# Altium schematic sheet [21] USB.SchDoc: USB
size 393 x 281 mm; SheetNumber: 21; SheetTotal: 21; PageSetup: Record=PageOptions|CenterHorizontal=True|CenterVertical=True|PrintScale=0.94|XCorrection=0.00|YCorrection=0.00|PrintKind=0|BorderSize=5000000|LeftOffset=0|BottomOffset=0|Orientation=2|PaperLength=1000|PaperWidth=1000|Scale=100|PaperSource=15|PrintQuality=600|MediaType=1|DitherType=10|PrintScaleMode=1|PaperKind=A4; Adr1: August Barks gata 6B; Adr2: SE-421 32 Västra Frölunda; Adr3: Sweden; Webpage: www.omnisys.se
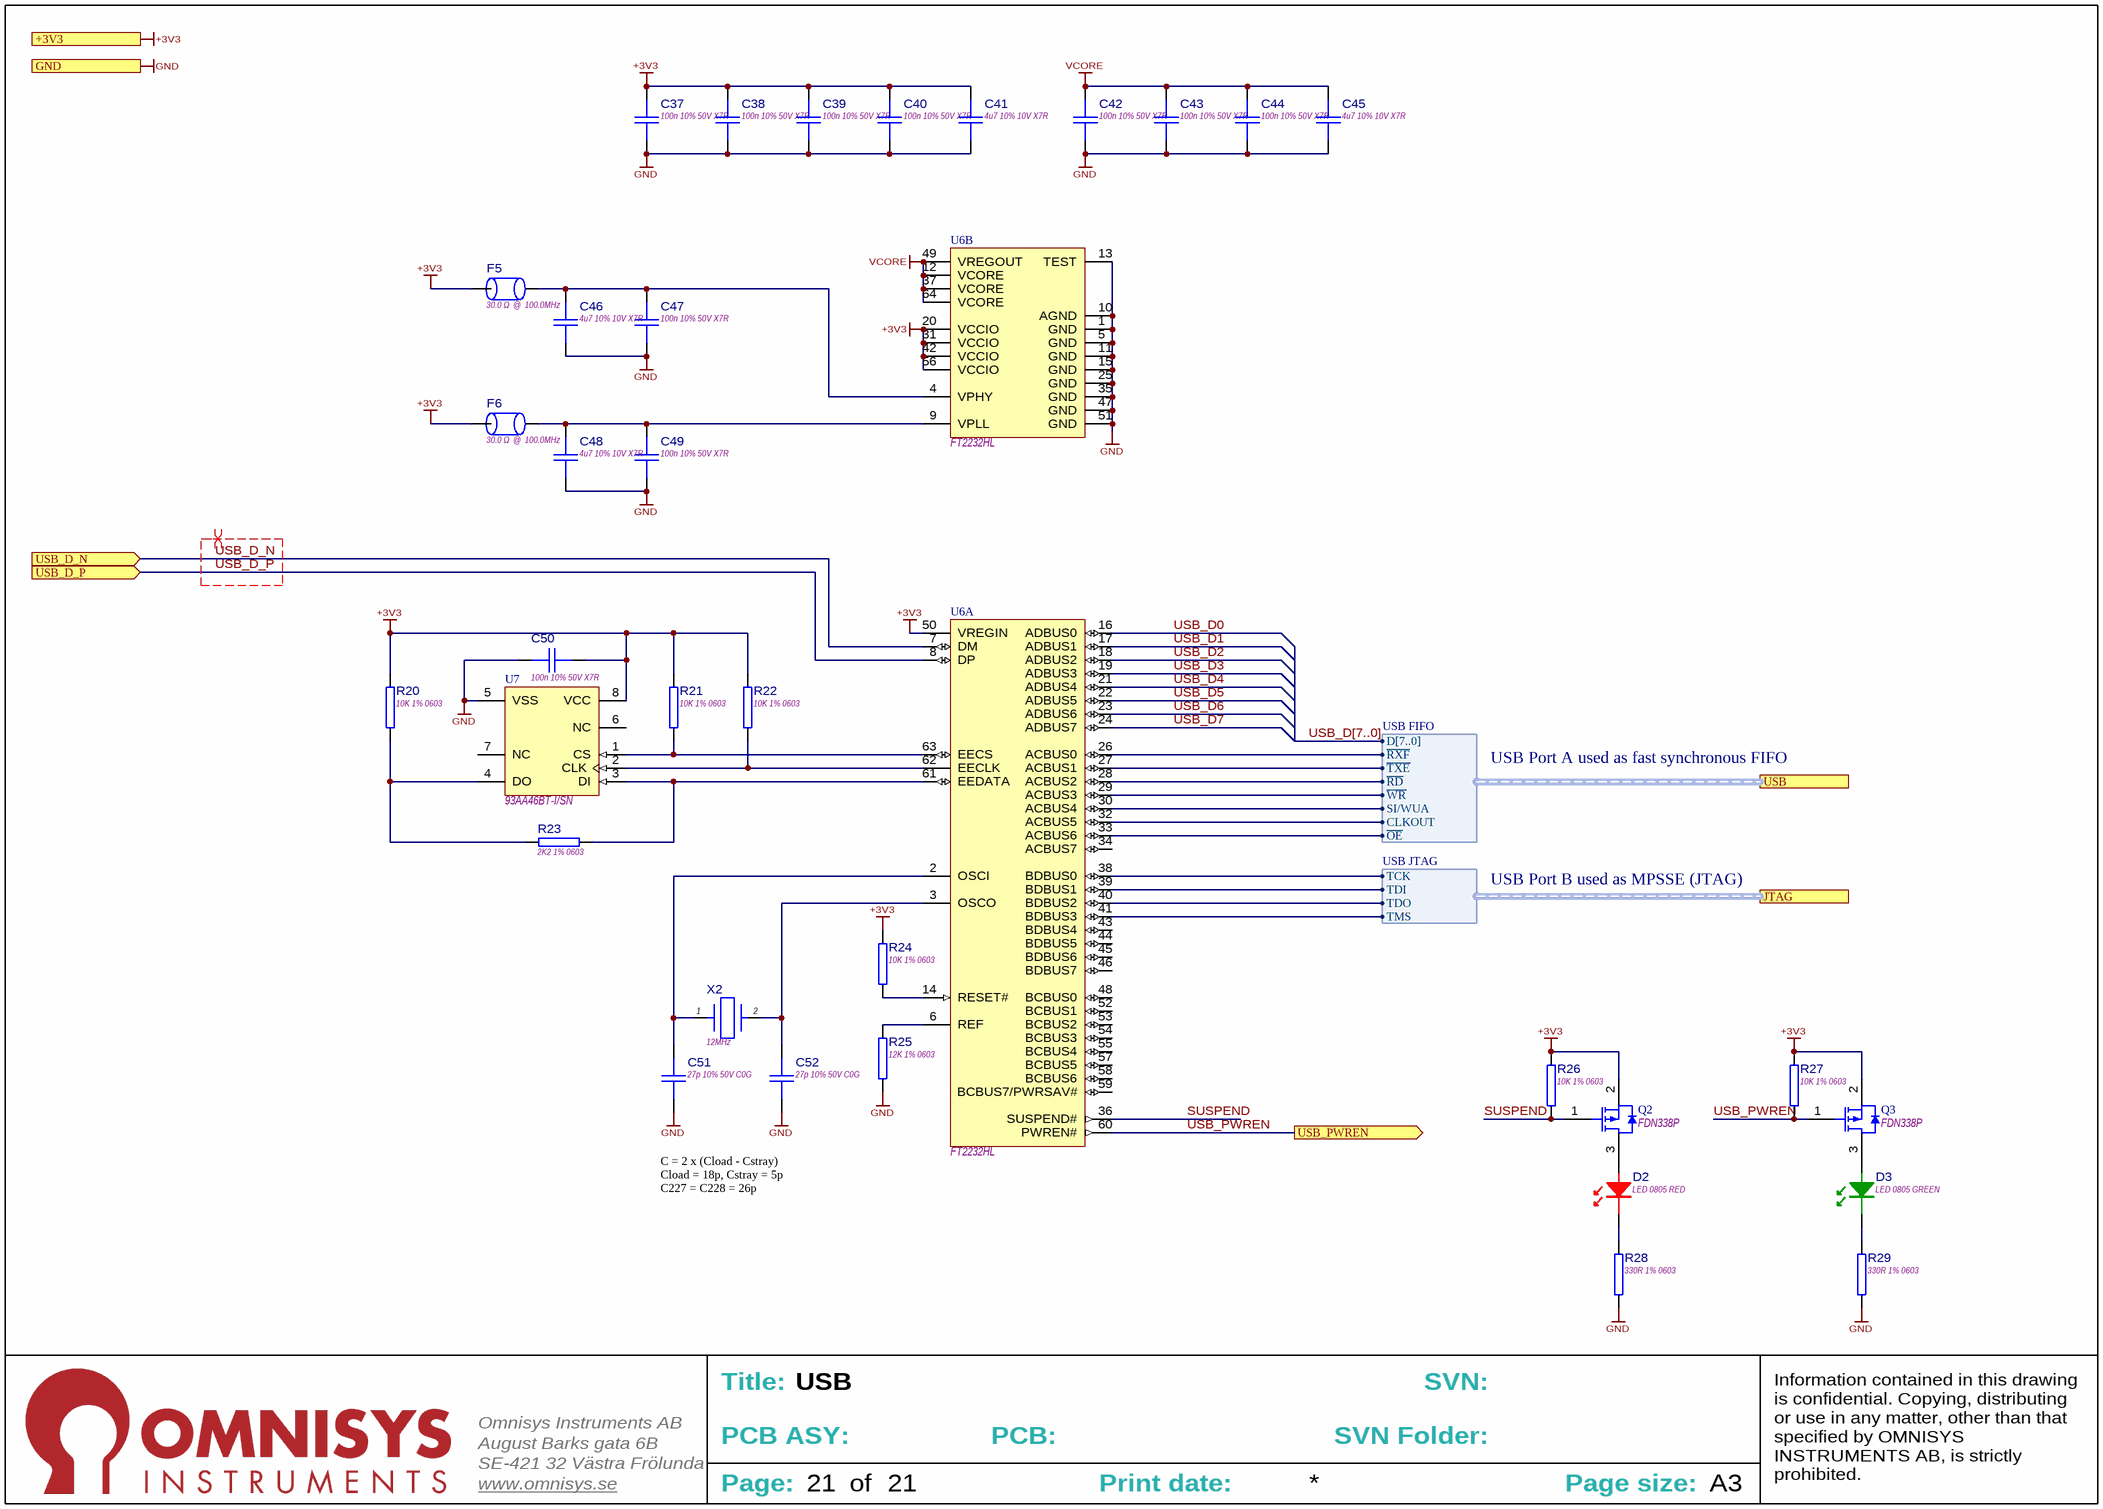
[diagram p0: [21] USB.SchDoc]

## Parts
C37  100n 10% 50V X7R  [CAPC1608X90N]
C38  100n 10% 50V X7R  [CAPC1608X90N]
C39  100n 10% 50V X7R  [CAPC1608X90N]
C40  100n 10% 50V X7R  [CAPC1608X90N]
C41  4u7 10% 10V X7R  [CAPC2012X145N]
C42  100n 10% 50V X7R  [CAPC1608X90N]
C43  100n 10% 50V X7R  [CAPC1608X90N]
C44  100n 10% 50V X7R  [CAPC1608X90N]
C45  4u7 10% 10V X7R  [CAPC2012X145N]
C46  4u7 10% 10V X7R  [CAPC2012X145N]
C47  100n 10% 50V X7R  [CAPC1608X90N]
C48  4u7 10% 10V X7R  [CAPC2012X145N]
C49  100n 10% 50V X7R  [CAPC1608X90N]
C50  100n 10% 50V X7R  [CAPC1608X90N]
C51  27p 10% 50V C0G  [CAPC1608X90N]
C52  27p 10% 50V C0G  [CAPC1608X90N]
D2  LED 0805 RED  [LED2012-RED]
D3  LED 0805 GREEN  [LED2012-GREEN]
F5  30.0 Ω  @  100.0MHz  [INDC2012X11N]
F6  30.0 Ω  @  100.0MHz  [INDC2012X11N]
Q2  FDN338P  [SOT95P230X110-3N]
Q3  FDN338P  [SOT95P230X110-3N]
R20  10K 1% 0603  [RESC1608N]
R21  10K 1% 0603  [RESC1608N]
R22  10K 1% 0603  [RESC1608N]
R23  2K2 1% 0603  [RESC1608N]
R24  10K 1% 0603  [RESC1608N]
R25  12K 1% 0603  [RESC1608N]
R26  10K 1% 0603  [RESC1608N]
R27  10K 1% 0603  [RESC1608N]
R28  330R 1% 0603  [RESC1608N]
R29  330R 1% 0603  [RESC1608N]
U6  FT2232HL  [FTDI-LQFP-64_L]  (parts A,B of 2)
U7  93AA46BT-I/SN  [SOIC127P600X175-8N]
X2  12MHz  [XTAL_5x3.2MM]

## Ports
+3V3, GND, JTAG (harness USB JTAG), USB (harness USB FIFO), USB_D_N (in), USB_D_P (in), USB_PWREN (out)

## Harnesses
USB JTAG: TCK, TDI, TDO, TMS
USB FIFO: D[7..0], ~{RXF}, ~{TXE}, ~{RD}, ~{WR}, SI/WUA, CLKOUT, ~{OE}

## Nets
+3V3: C37.1 C38.1 C39.1 C40.1 C41.2 C50.2 F5.1 F6.1 Q2.2(SOURCE) Q3.2(SOURCE) R20.2 R21.2 R22.2 R24.1 R26.2 R27.2 U6.20(VCCIO) U6.31(VCCIO) U6.42(VCCIO) U6.50(VREGIN) U6.56(VCCIO) U7.8(VCC) ; port +3V3
GND: C37.2 C38.2 C39.2 C40.2 C41.1 C42.2 C43.2 C44.2 C45.1 C46.1 C47.1 C48.1 C49.1 C50.1 C51.1 C52.1 R25.1 R28.1 R29.1 U6.1(GND) U6.5(GND) U6.10(AGND) U6.11(GND) U6.13(TEST) U6.15(GND) U6.25(GND) U6.35(GND) U6.47(GND) U6.51(GND) U7.5(VSS) ; port GND
VCORE: C42.1 C43.1 C44.1 C45.2 U6.12(VCORE) U6.37(VCORE) U6.49(VREGOUT) U6.64(VCORE)
SUSPEND: Q2.1(GATE) R26.1 U6.36(SUSPEND#)
USB_D0: U6.16(ADBUS0)
USB_D1: U6.17(ADBUS1)
USB_D2: U6.18(ADBUS2)
USB_D3: U6.19(ADBUS3)
USB_D4: U6.21(ADBUS4)
USB_D5: U6.22(ADBUS5)
USB_D6: U6.23(ADBUS6)
USB_D7: U6.24(ADBUS7)
USB_D_N: U6.7(DM) ; port USB_D_N
USB_D_P: U6.8(DP) ; port USB_D_P
USB_PWREN: Q3.1(GATE) R27.1 U6.60(PWREN#) ; port USB_PWREN
NetC46_2: C46.2 C47.2 F5.2 U6.4(VPHY)
NetC48_2: C48.2 C49.2 F6.2 U6.9(VPLL)
NetC51_2: C51.2 U6.2(OSCI) X2.1
NetC52_2: C52.2 U6.3(OSCO) X2.2
NetD2_1: D2.1 R28.2
NetD2_2: D2.2 Q2.3(DRAIN)
NetD3_1: D3.1 R29.2
NetD3_2: D3.2 Q3.3(DRAIN)
NetR20_1: R20.1 R23.1 U7.4(DO)
NetR21_1: R21.1 U6.63(EECS) U7.1(CS)
NetR22_1: R22.1 U6.62(EECLK) U7.2(CLK)
NetR23_2: R23.2 U6.61(EEDATA) U7.3(DI)
NetR24_2: R24.2 U6.14(RESET#)
NetR25_2: R25.2 U6.6(REF)
NetU6_26: U6.26(ACBUS0) ; port USB.~{RXF}
NetU6_27: U6.27(ACBUS1) ; port USB.~{TXE}
NetU6_28: U6.28(ACBUS2) ; port USB.~{RD}
NetU6_29: U6.29(ACBUS3) ; port USB.~{WR}
NetU6_30: U6.30(ACBUS4) ; port USB.SI/WUA
NetU6_32: U6.32(ACBUS5) ; port USB.CLKOUT
NetU6_33: U6.33(ACBUS6) ; port USB.~{OE}
NetU6_38: U6.38(BDBUS0) ; port JTAG.TCK
NetU6_39: U6.39(BDBUS1) ; port JTAG.TDI
NetU6_40: U6.40(BDBUS2) ; port JTAG.TDO
NetU6_41: U6.41(BDBUS3) ; port JTAG.TMS

Not connected (* = marked no-connect by the designer): U6 34(ACBUS7) 43(BDBUS4) 44(BDBUS5) 45(BDBUS6) 46(BDBUS7) 48(BCBUS0) 52(BCBUS1) 53(BCBUS2) 54(BCBUS3) 55(BCBUS4) 57(BCBUS5) 58(BCBUS6) 59(BCBUS7/PWRSAV#); U7 6(NC) 7(NC)

## Buses and harness runs
bus USB_D[7..0]

## Layout directives
differential pair; rule Differential Pairs Routing [Pref Gap = 0.1mm    Min Gap  = 0.1mm    Max Gap  = 0.1mmPref Width = 0.1mm    Min Width  = 0.1mm    Max Width  = 0.1mm]; net class Diffpairs_USB: USB_D_N, USB_D_P

## Notes on the sheet
- USB Port A used as fast synchronous FIFO
- USB Port B used as MPSSE (JTAG)
- C = 2 x (Cload - Cstray)
  Cload = 18p, Cstray = 5p
  C227 = C228 = 26p
- Title:
- SVN:
- August Barks gata 6B
- SE-421 32 Västra Frölunda
- Omnisys Instruments AB
- PCB ASY:
- PCB:
- SVN Folder:
- www.omnisys.se
- Page:
- of
- Print date:
- Page size:
- A3
- Information contained in this drawing is confidential. Copying, distributing or use in any matter, other than that specified by OMNISYS INSTRUMENTS AB, is strictly prohibited.

## Library data of the parts
C37-C40 C42-C44 C47 C49 C50 = CMP-0300-002665-6: Ceramic Chip Capacitor, 0603/1608; Capacitance: 100nF; Package: 1608/0603; Temperature Charateristics: X7R; Tolerance: 10%; Rated Voltage: 50V; Thickness: 900µm; Weight: 9mg
C41 C45 C46 C48 = CMP-0300-003983-5: Ceramic Chip Capacitor, 0805/2012; Capacitance: 4.7µF; Package: 2012/0805; Temperature Charateristics: X7R; Tolerance: 10%; Thickness: 1.4mm; Rated Voltage: 10V
C51 C52 = CMP-0300-002442-6: Ceramic Chip Capacitor, 0603/1608; Tolerance: 5%; Capacitance: 27pF; Package: 1608/0603; Temperature Charateristics: C0G; Rated Voltage: 50V; Thickness: 900µm; Weight: 9mg
D2 = CMP-1500-000001-3
D3 = CMP-1500-000004-3
F5 F6 = CMP-0600-000010-2: Ferrite bead, Würth Elektronik WE-CBF 2012 (0805), 74279206 ,  30.0 Ω  @  100.0MHz; Zmax@Freq: 55.0 Ω  @      1.0 GHz; Type: High Current; RDC: 25.0 mΩ; IDC: 3.0 A; Z@Freq: 30.0 Ω  @  100.0MHz; PartNumber: 74279206
Q2 Q3 = CMP-1700-000037-1: ON SEMICONDUCTOR - FDN338P - P CHANNEL MOSFET, -20V, 1.6A SUPER SOT-3; Drain to Source Voltage (Vdss): 20V; Current Rating: -1.6A; Drain to Source Resistance: 115mR; Element Configuration: Single; Fall Time: 11ns; Gate to Source Voltage (Vgs): 8V; Input Capacitance: 451pF; Max Power Dissipation: 460mW; Nominal Vgs: -800mV; Number of Elements: 1; Power Dissipation: 500mW; RDS(on): 0.115; Turn-Off Delay Time: 16ns; Turn-On Delay Time: 10ns; Packaging: Tape and Reel; Case/Package: TO-236-3; Contact Plating: Tin,Matte; Continuous Drain Current (ID): 1.6A; Drain to Source Breakdown Voltage: -20V; Lead Free: Lead Free; Max Operating Temperature: 150°C; Min Operating Temperature: -55°C; Mount: Surface Mount; Number of Pins: 3; On-State Resistance: 115mR; Package Quantity: 3000; PartNumber: FDN338P; Radiation Hardening: No; Rds On Max: 115mR; REACH SVHC: No SVHC; Rise Time: 11ns; Threshold Voltage: -800mV; Voltage Rating (DC): -20V; Weight: 0.03g
R20-R22 R24 R26 R27 = CMP-1800-002045-5: Thick film Chip Resistor, 0603/1608; Power: 100mW; Maximum working voltage: 75V; Temp. Coefficent: 0.01%; Value: 10k; Tolerance: 1%; Case/Package: 0603/1608; Composition: Thick film
R23 = CMP-1800-002029-5: Thick film Chip Resistor, 0603/1608; Value: 2.2k; Power: 100mW; Maximum working voltage: 75V; Temp. Coefficent: 0.01%; Tolerance: 1%; Case/Package: 0603/1608; Composition: Thick film
R25 = CMP-1800-002047-5: Thick film Chip Resistor, 0603/1608; Power: 100mW; Maximum working voltage: 75V; Temp. Coefficent: 0.01%; Value: 12k; Tolerance: 1%; Case/Package: 0603/1608; Composition: Thick film
R28 R29 = CMP-1800-002010-5: Thick film Chip Resistor, 0603/1608; Value: 330; Power: 100mW; Maximum working voltage: 75V; Temp. Coefficent: 0.01%; Tolerance: 1%; Case/Package: 0603/1608; Composition: Thick film
U6 = CMP-2100-000591-1: FTDI Chip FT2232HL Dual UART Interface RS232, RS422, RS485 480Mbit/s, 64-Pin, LQFP; Length: 10mm; Width: 10mm; Height: 1.4mm; Case/Package: LQFP; Lead Free: Lead Free; Max Operating Temperature: 85°C; Min Operating Temperature: -40°C; Mount: Surface Mount; Number of Pins: 64
U7 = CMP-2100-000589-1: IC EEPROM 1KBIT 2MHZ 8SOIC; Access Time: 250ns; Density: 1Kb; Interface: Serial; Max Frequency: 1MHz; Max Supply Voltage: 5.5V; Min Supply Voltage: 1.8V; Nominal Supply Current: 2mA; Case/Package: SOIC; Frequency: 2MHz; Lead Free: Lead Free; Max Operating Temperature: 85°C; Memory Size: 1Kb; Memory Type: EEPROM; Min Operating Temperature: -40°C; Mount: Surface Mount; Number of Pins: 8; Package Quantity: 3300; Packaging: Tape and Reel; Radiation Hardening: No
X2 = CMP-2400-000025-1: 12MHz 5 x 3.2 mm SMD GLASS CRYSTAL; ESR (Equivalent Series Resistance): 80R; Frequency Stability: 30ppm; Load Capacitance: 12pF; Case/Package: SMD/SMT; Depth: 3.2mm; Frequency: 12MHz; Frequency Tolerance: 30ppm; Height: 0.053inch; Lead Free: Contains Lead; Length: 5mm; Max Operating Temperature: 85°C; Min Operating Temperature: -40°C; Mount: Surface Mount; Number of Pins: 2; Package Quantity: 1; Packaging: Tape and Reel; Series Resistance: 80R; Width: 0.126inch